# EasyEDA Pro project ProPrj_dataloger_2025-03-19.epro

# Schematic Schematic2
Board Name: STM32; Create Date: 2024-11-12; Page Name: P1; Project Name: dataloger; Schematic Name: Schematic2; Update Date: 2025-01-06; Company: 嘉立创EDA; Page Size: A4; Version: V1.0
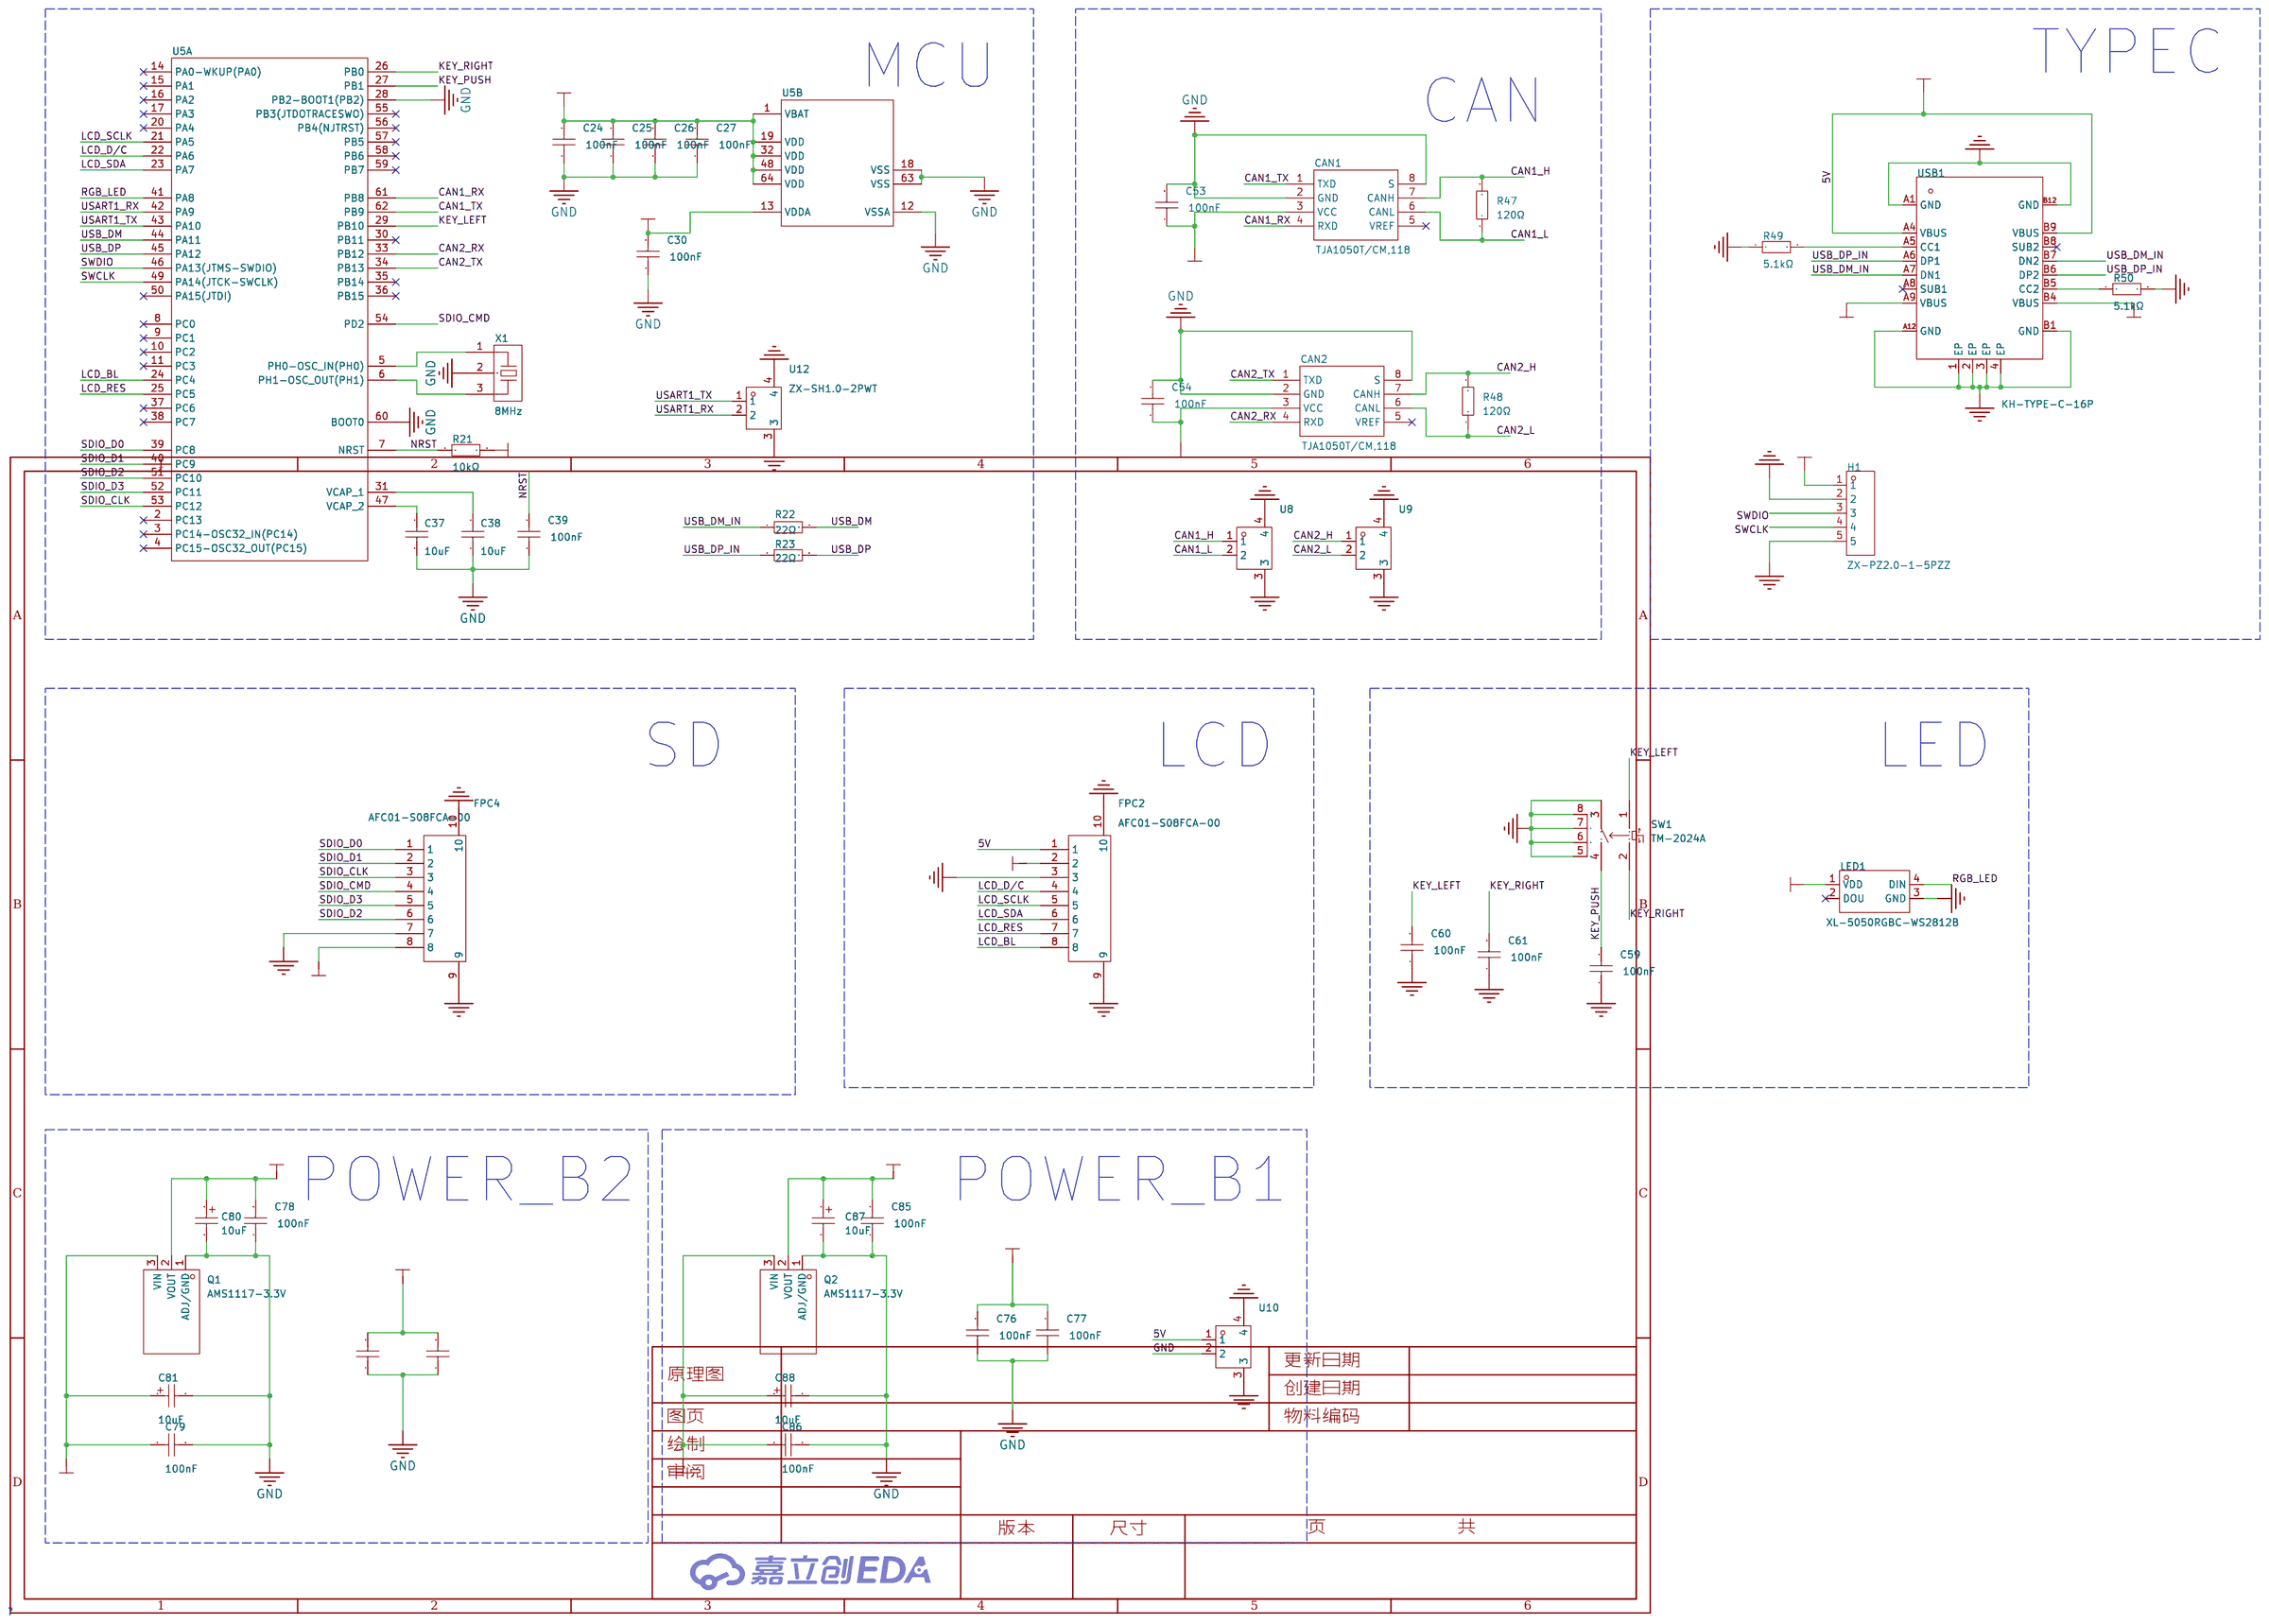
[diagram p0: schematic sheet]

## Parts
C24  100nF  [C0402]
C25  100nF  [C0402]
C26  100nF  [C0402]
C27  100nF  [C0402]
C30  100nF  [C0402]
C37  10uF  [C0402]
C38  10uF  [C0402]
C39  100nF  [C0402]
C53  100nF  [C0402]
C54  100nF  [C0402]
C59  100nF  [C0402]
C60  100nF  [C0402]
C61  100nF  [C0402]
C76  100nF  [C0402]
C77  100nF  [C0402]
C78  100nF  [C0402]
C79  100nF  [C0402]
C80  10uF  [CASE-A_3216]
C81  10uF  [CASE-A_3216]
C83  100nF  [C0402]
C85  100nF  [C0402]
C86  100nF  [C0402]
C87  10uF  [CASE-A_3216]
C88  10uF  [CASE-A_3216]
C89  100nF  [C0402]
CAN1  TJA1050T/CM,118  [SOIC-8_L5.0-W4.0-P1.27-LS6.0-BL]
CAN2  TJA1050T/CM,118  [SOIC-8_L5.0-W4.0-P1.27-LS6.0-BL]
FPC2  AFC01-S08FCA-00  [FPC-SMD_P0.50-8P_FGS-XJ-H2.0]
FPC4  AFC01-S08FCA-00  [FPC-SMD_P0.50-8P_FGS-XJ-H2.0]
H1  ZX-PZ2.0-1-5PZZ  [HDR-TH_5P-P2.00-V-M]
LED1  XL-5050RGBC-WS2812B  [LED-SMD_4P-L5.0-W5.0-BL_XL-5050RGBC]
Q1  AMS1117-3.3V  [SOT-89-3_L4.5-W2.5-P1.50-LS4.2-BR]
Q2  AMS1117-3.3V  [SOT-89-3_L4.5-W2.5-P1.50-LS4.2-BR]
R21  10kΩ  [R0402]
R22  22Ω  [R0402]
R23  22Ω  [R0402]
R47  120Ω  [R0402]
R48  120Ω  [R0402]
R49  5.1kΩ  [R0402]
R50  5.1kΩ  [R0402]
SW1  TM-2024A  [SW-SMD_TM-2024A]
U5  -  [LQFP-64_L10.0-W10.0-P0.50-LS12.0-BL]  (sections 1,2)
U8  WAFER-SH1.0-2PWB  [CONN-SMD_2P-P1.00_XUNPU_WAFER-SH1.0-2PWB]
U9  WAFER-SH1.0-2PWB  [CONN-SMD_2P-P1.00_XUNPU_WAFER-SH1.0-2PWB]
U10  WAFER-SH1.0-2PWB  [CONN-SMD_2P-P1.00_XUNPU_WAFER-SH1.0-2PWB]
U12  ZX-SH1.0-2PWT  [CONN-SMD_2P-P1.00_HX-1.0-2P-WT]
USB1  KH-TYPE-C-16P  [USB-C-SMD_KH-TYPE-C-16P]
X1  8MHz  [OSC-SMD_3P-L3.2-W1.3-P1.2-L]

## Library data of the parts
C24-C27 C30 C39 C53 C54 C59-C61 C76-C79 C83 C85 C86 C89 = CC0402KRX7R9BB104: 容值:100nF;精度:±10%;额定电压:50V;温度系数:X7R;; LCSC Part Name: 100nF ±10% 50V; Supplier Part: C131394; Manufacturer: YAGEO(国巨); Supplier Footprint: 0402; Datasheet: https://atta.szlcsc.com/upload/public/pdf/source/20170925/C131394_1506321459057990237.pdf; Supplier: LCSC; Tolerance: ±10%; Voltage Rated: 50V; Temperature Coefficient: X7R
C37 C38 = CC0402MRX5R5BB106: 容值:10uF;精度:±20%;额定电压:6.3V;温度系数:X5R;; LCSC Part Name: 10uF ±20% 6.3V; Supplier Part: C105884; Manufacturer: YAGEO(国巨); Supplier Footprint: 0402; Datasheet: https://atta.szlcsc.com/upload/public/pdf/source/20170728/C105884_1501225684064848716.pdf; Supplier: LCSC; Tolerance: ±20%; Voltage Rated: 6.3V; Temperature Coefficient: X5R
C80 C81 C87 C88 = TAJA106K010RNJ: 容值:10uF;精度:±10%;额定电压:10V;等效串联电阻:3Ω@100kHz;; LCSC Part Name: 10uF ±10% 10V; Supplier Part: C7177; Manufacturer: Kyocera AVX; Supplier Footprint: CASE-A-3216; JLCPCB Part Class: 扩展库; Datasheet: https://atta.szlcsc.com/upload/public/pdf/source/20160107/1457707750344.pdf; Supplier: LCSC; Tolerance: ±10%; Rated Voltage: 10V; Equivalent Series Resistance(ESR): 3Ω@100kHz; Operating Temperature: -55℃~+125℃
CAN1 CAN2 = TJA1050T/CM,118: 类型:收发器;协议类别:CAN总线;; Supplier Part: C6952; Manufacturer: NXP(恩智浦); Supplier Footprint: SOIC-8_150mil; JLCPCB Part Class: Basic Part; Datasheet: https://atta.szlcsc.com/upload/public/pdf/source/20140411/1457707042917.pdf; Supplier: LCSC; Type: 收发器; Protocol: CAN总线; Supply Voltage: 4.75V ~ 5.25V
FPC2 FPC4 = AFC01-S08FCA-00: 锁定特性:翻盖式;触点类型:下接;触点数量:8P;间距:0.5mm;安装类型:卧贴;; LCSC Part Name: 间距:0.5mm P数:8P 翻盖式 下接; Supplier Part: C262657; Manufacturer: JS(钜硕电子); Supplier Footprint: SMD,P=0.5mm,卧贴; JLCPCB Part Class: 扩展库; Datasheet: https://atta.szlcsc.com/upload/public/pdf/source/20190816/C413942_2A72D1AC756EAE17EEDF756A339D4500.pdf; Supplier: LCSC; Locking Feature: 翻盖式; Contact Type: 下接; Number of Contacts: 8P; Pitch: 0.5mm; Mounting Type: 卧贴; FFC, FCB Thickness: 0.3mm; Height Above Board: 2mm
H1 = ZX-PZ2.0-1-5PZZ: 插针结构:1x5P;间距:2mm;行距:-;圆针/方针:方针;安装类型:直插;排数:单排;总PIN位数:5P;额定电流:1.5A;额定电压:500V;配合针长度:3.9mm;塑高:2mm;端接针长度:2.8mm;触头材质:黄铜;触头镀层:金;工作温度范围:-40℃~+105℃;焊接温度(最大值):-;颜色:黑色;; LCSC Part Name: 1x5P 间距:2mm 方针 直插; Supplier Part: C7501286; Manufacturer: Megastar(兆星); Supplier Footprint: 插件,P=2mm; JLCPCB Part Class: Extended Part; Datasheet: https://atta.szlcsc.com/upload/public/pdf/source/20230809/E150E06394DAD00A792C01E768CBE2ED.pdf; Supplier: LCSC; Pin Structure: 1x5P; Pitch: 2mm; Circluar Pins/Square Pins: 方针; Mounting Type: 直插; Number of Rows: 单排; Number of Pins: 5P; Current Rating (Max): 1.5A; Voltage Rating (Max): 500V; Length of Mating Pin: 3.9mm; Insulation Height: 2mm; Length of End Connection Pin: 2.8mm; Contact Material: 黄铜; Contact Plating: 金; Operating Temperature Range: -40℃~+105℃; Color: 黑色
LED1 = XL-5050RGBC-WS2812B: 5050七彩幻彩透明贴片LED灯珠 5050 幻彩透明四脚 ws2812B 内置驱动IC; Supplier Part: C2843785; Manufacturer: XINGLIGHT(成兴光); Supplier Footprint: SMD5050; JLCPCB Part Class: 扩展库; Datasheet: https://atta.szlcsc.com/upload/public/pdf/source/20240412/E1004CAA80592E31D08BFE019083806F.pdf; Supplier: LCSC
Q1 Q2 = AMS1117-3.3V_C5120796: 输出类型:固定;最大输入电压:18V;输出电压:3.3V;最大输出电流:1A;输出极性:正极;; LCSC Part Name: 输入18V 输出3.3V 1A; Supplier Part: C5120796; Manufacturer: MSKSEMI(美森科); Supplier Footprint: SOT-89; JLCPCB Part Class: Extended Part; Datasheet: https://atta.szlcsc.com/upload/public/pdf/source/20220727/5E62EAC46FFFF83337622C0FBE1B6BF8.pdf; Supplier: LCSC; Output Type: 固定; Maximum Input Voltage: 18V; Output Voltage: 3.3V; MAX Output Current: 1A; Dropout Voltage: 1.4V@(1A); standby current: 12mA; Operating Temperature: 0℃~+125℃; Output Polarity: 正极; Number of Outputs: 1
R21 = 0402WGF1002TCE: 电阻类型:厚膜电阻;阻值:10kΩ;精度:±1%;功率:62.5mW;温度系数:±100ppm/;最大工作电压:50V;工作温度范围:-55~+155;; LCSC Part Name: 10kΩ ±1% 62.5mW; Supplier Part: C25744; Manufacturer: UNI-ROYAL(厚声); Supplier Footprint: 0402; Datasheet: https://atta.szlcsc.com/upload/public/pdf/source/20200306/C422600_1E6D84923E4A46A82E41ADD87F860B5C.pdf; Supplier: LCSC; Type: 厚膜电阻; Tolerance: ±1%; Power(Watts): 62.5mW; Temperature Coefficient: ±100ppm/; Overload Voltage (Max): 50V; Operating Temperature Range: -55~+155
R22 R23 = CR0402FF22R0G: 电阻类型:厚膜电阻;阻值:22Ω;精度:±1%;功率:1/16W;温度系数:±200ppm/;最大工作电压:50V;工作温度范围:-55~+125;; LCSC Part Name: 22Ω ±1%; Supplier Part: C100318; Manufacturer: LIZ(丽智电子); Supplier Footprint: 0402; Datasheet: https://atta.szlcsc.com/upload/public/pdf/source/20170408/1491621411980.pdf; Supplier: LCSC; Type: 厚膜电阻; Tolerance: ±1%; Power(Watts): 1/16W; Temperature Coefficient: ±200ppm/; Overload Voltage (Max): 50V; Operating Temperature Range: -55~+125
R47 R48 = 0402WGF1200TCE: 电阻类型:厚膜电阻;阻值:120Ω;精度:±1%;功率:62.5mW;最大工作电压:50V;温度系数:±100ppm/℃;; LCSC Part Name: 120Ω ±1% 62.5mW 厚膜电阻; Supplier Part: C25079; Manufacturer: UNI-ROYAL(厚声); Supplier Footprint: 0402; JLCPCB Part Class: 基础库; Datasheet: https://atta.szlcsc.com/upload/public/pdf/source/20200306/C422600_1E6D84923E4A46A82E41ADD87F860B5C.pdf; Supplier: LCSC; Type: 厚膜电阻; Tolerance: ±1%; Power(Watts): 62.5mW; Overload Voltage (Max): 50V; Temperature Coefficient: ±100ppm/℃; Operating Temperature Range: -55℃~+155℃
R49 R50 = 0402WGF5101TCE: 电阻类型:厚膜电阻;阻值:5.1kΩ;精度:±1%;功率:62.5mW;最大工作电压:50V;温度系数:±100ppm/℃;; LCSC Part Name: 5.1kΩ ±1% 62.5mW 厚膜电阻; Supplier Part: C25905; Manufacturer: UNI-ROYAL(厚声); Supplier Footprint: 0402; JLCPCB Part Class: 基础库; Datasheet: https://atta.szlcsc.com/upload/public/pdf/source/20200306/C422600_1E6D84923E4A46A82E41ADD87F860B5C.pdf; Supplier: LCSC; Type: 厚膜电阻; Tolerance: ±1%; Power(Watts): 62.5mW; Overload Voltage (Max): 50V; Temperature Coefficient: ±100ppm/℃; Operating Temperature Range: -55℃~+155℃
SW1 = TM-2024A: 四脚两档拨轮开关TM-2024A; LCSC Part Name: 四脚两档拨轮开关TM-2024A; Supplier Part: C561480; Manufacturer: XKB Connection(中国星坤); Supplier Footprint: SMD; JLCPCB Part Class: 扩展库; Datasheet: https://atta.szlcsc.com/upload/public/pdf/source/20211011/7A4DB3DC37E7D5823B6D92C66ED3191E.pdf; Supplier: LCSC
U5 = STM32F405RGT6: 主频（MAX):168MHz;工作电压:1.8V ~ 3.6V;; Supplier Part: C15742; Manufacturer: ST(意法半导体); Supplier Footprint: LQFP-64_10x10x05P; Datasheet: https://atta.szlcsc.com/upload/public/pdf/source/20140724/1457707160365.pdf; Supplier: LCSC; Speed: 168MHz; Voltage - Supply (Vcc/Vdd): 1.8V ~ 3.6V; Program Memory Size: 1MB; RAM Size: 192KB; Number of I/O: 51; A/D: 16x12bit; D/A: 2x12bit; PWM: 56; LCD: MOTOROLA 6800 AND INTEL  8080 TYPE LCD DIRECTLY; UART/USART: 4 USART+2 UART; SPI: 3; I2C（SMBUS/PMBUS）: 3; USB Device: 1; USB Host/OTG: 1; CAN: 2
U8-U10 = WAFER-SH1.0-2PWB: 插针结构:1x2P;间距:1mm;安装方式:卧贴;总PIN数:2P;排数:1;每排PIN数:2;额定电流:1A;工作温度范围:-25℃~+85℃;; LCSC Part Name: 1x2P 间距:1mm 卧贴; Supplier Part: C3029341; Manufacturer: XUNPU(讯普); Supplier Footprint: SMD,P=1mm,卧贴; JLCPCB Part Class: Extended Part; Datasheet: https://atta.szlcsc.com/upload/public/pdf/source/20220527/1879B8210BD3B2006BCEAC1A40D397B6.pdf; Supplier: LCSC; Pins Structure: 1x2P; Pitch: 1mm; Mounting Style: 卧贴; Number of Pins: 2P; Number of Rows: 1; Number of PINs Per Row: 2; Current Rating (Max): 1A; Operating Temperature Range: -25℃~+85℃
U12 = ZX-SH1.0-2PWT: 插针结构:1x2P;间距:1mm;安装方式:卧贴;参考系列:SH;总PIN数:2P;排数:1;每排PIN数:2;行距:-;额定电流:1A;触头材质:黄铜;触头镀层:锡;工作温度范围:-25℃~+85℃;; Supplier Part: C7430444; Manufacturer: Megastar(兆星); Supplier Footprint: SMD,P=1mm,卧贴; JLCPCB Part Class: 扩展库; Datasheet: https://atta.szlcsc.com/upload/public/pdf/source/20230619/7431D9A6D6A5DA3D0954B6B913C94054.pdf; Supplier: LCSC; Pins Structure: 1x2P; Pitch: 1mm; Mounting Style: 卧贴; Reference Series: SH; Number of Pins: 2P; Number of Rows: 1; Number of PINs Per Row: 2; Current Rating (Max): 1A; Contact Material: 黄铜; Contact Plating: 锡; Operating Temperature Range: -25℃~+85℃
USB1 = KH-TYPE-C-16P: 连接器类型:Type-C;标准:-;公母:母;端口数量:1;触点数量:16P;安装方式:卧贴;额定电流 - 电源:3A;工作温度范围:-40℃~+85℃;; LCSC Part Name: Type-C 母 卧贴; Supplier Part: C709357; Manufacturer: kinghelm(金航标); Supplier Footprint: SMD; JLCPCB Part Class: 扩展库; Datasheet: https://atta.szlcsc.com/upload/public/pdf/source/20200911/C709357_AA8DCEB38BB20E3035A7ED7AE7667837.pdf; Supplier: LCSC; Connector Type: Type-C; Gender: 母; Number of Ports: 1; Number of Contacts: 16P; Mounting Style: 卧贴; Current Rating - Power (Max): 3A; Operating Temperature Range: -40℃~+85℃
X1 = CSTCE8M00G15C99-R0: 频率:8MHz;频率容差:±0.1%;内藏负载电容:33pF;谐振阻抗:40Ω;; LCSC Part Name: 8M ±0.1% 33pF; Supplier Part: C110614; Manufacturer: muRata(村田); Supplier Footprint: SMD3213-3P; Datasheet: https://atta.szlcsc.com/upload/public/pdf/source/20180327/C110614_9F5031E08ADB10DE4472527BF78A8CAF.pdf; Supplier: LCSC; Frequency Stability: ±0.13%; Frequency Tolerance: ±0.1%; Built-in Load Capacitance: 33pF; Resonant Impedance: 40Ω; Operating Temperature: -40~+125

## Nets
5V: C53.1 C54.1 C79.2 C81.1 C86.2 C88.1 CAN1.3(VCC) CAN2.3(VCC) FPC2.1 LED1.1(VDD) Q1.3(VIN) Q2.3(VIN) U10.1 USB1.A4(VBUS) USB1.A9(VBUS) USB1.B4(VBUS) USB1.B9(VBUS)
GND: C24.1 C25.1 C26.1 C27.1 C30.1 C37.1 C38.1 C39.1 C53.2 C54.2 C59.1 C60.1 C61.1 C76.1 C77.1 C78.1 C79.1 C80.2 C81.2 C83.1 C85.1 C86.1 C87.2 C88.2 C89.1 CAN1.2(GND) CAN1.8(S) CAN2.2(GND) CAN2.8(S) FPC2.3 FPC2.9 FPC2.10 FPC4.7 FPC4.9 FPC4.10 H1.2 H1.5 LED1.3(GND) Q1.1(ADJ/GND) Q2.1(ADJ/GND) R49.1 R50.2 SW1.3 SW1.5 SW1.6 SW1.7 SW1.8 U5.12(VSSA) U5.18(VSS) U5.28(PB2-BOOT1(PB2)) U5.60(BOOT0) U5.63(VSS) U8.3 U8.4 U9.3 U9.4 U10.2 U10.3 U10.4 U12.3 U12.4 USB1.1(EP) USB1.2(EP) USB1.3(EP) USB1.4(EP) USB1.A1(GND) USB1.A12(GND) USB1.B1(GND) USB1.B12(GND) X1.2
B1_3V3: C24.2 C25.2 C26.2 C27.2 C30.2 C76.2 C77.2 C85.2 C87.1 H1.1 Q2.2(VOUT) R21.1 U5.1(VBAT) U5.13(VDDA) U5.19(VDD) U5.32(VDD) U5.48(VDD) U5.64(VDD)
B2_3V3: C78.2 C80.1 C83.2 C89.2 FPC2.2 FPC4.8 Q1.2(VOUT)
CAN1_H: CAN1.7(CANH) R47.2 U8.1
CAN1_L: CAN1.6(CANL) R47.1 U8.2
CAN1_RX: CAN1.4(RXD) U5.61(PB8)
CAN1_TX: CAN1.1(TXD) U5.62(PB9)
CAN2_H: CAN2.7(CANH) R48.2 U9.1
CAN2_L: CAN2.6(CANL) R48.1 U9.2
CAN2_RX: CAN2.4(RXD) U5.33(PB12)
CAN2_TX: CAN2.1(TXD) U5.34(PB13)
KEY_LEFT: C60.2 SW1.1 U5.29(PB10)
KEY_PUSH: C59.2 SW1.4 U5.27(PB1)
KEY_RIGHT: C61.2 SW1.2 U5.26(PB0)
LCD_BL: FPC2.8 U5.24(PC4)
LCD_D/C: FPC2.4 U5.22(PA6)
LCD_RES: FPC2.7 U5.25(PC5)
LCD_SCLK: FPC2.5 U5.21(PA5)
LCD_SDA: FPC2.6 U5.23(PA7)
NRST: C39.2 R21.2 U5.7(NRST)
RGB_LED: LED1.4(DIN) U5.41(PA8)
SDIO_CLK: FPC4.3 U5.53(PC12)
SDIO_CMD: FPC4.4 U5.54(PD2)
SDIO_D0: FPC4.1 U5.39(PC8)
SDIO_D1: FPC4.2 U5.40(PC9)
SDIO_D2: FPC4.6 U5.51(PC10)
SDIO_D3: FPC4.5 U5.52(PC11)
SWCLK: H1.4 U5.49(PA14(JTCK-SWCLK))
SWDIO: H1.3 U5.46(PA13(JTMS-SWDIO))
USART1_RX: U5.42(PA9) U12.2
USART1_TX: U5.43(PA10) U12.1
USB_DM: R22.2 U5.44(PA11)
USB_DM_IN: R22.1 USB1.A7(DN1) USB1.B7(DN2)
USB_DP: R23.2 U5.45(PA12)
USB_DP_IN: R23.1 USB1.A6(DP1) USB1.B6(DP2)
$1N5097: U5.5(PH0-OSC_IN(PH0)) X1.1
$1N5098: U5.6(PH1-OSC_OUT(PH1)) X1.3
$1N5099: C38.2 U5.31(VCAP_1)
$1N5100: C37.2 U5.47(VCAP_2)
$1N7761: R49.2 USB1.A5(CC1)
$1N7765: R50.1 USB1.B5(CC2)

Not connected (* = marked no-connect by the designer): CAN1 5(VREF)*; CAN2 5(VREF)*; LED1 2(DOU)*; U5 2(PC13)* 3(PC14-OSC32_IN(PC14))* 4(PC15-OSC32_OUT(PC15))* 8(PC0)* 9(PC1)* 10(PC2)* 11(PC3)* 14(PA0-WKUP(PA0))* 15(PA1)* 16(PA2)* 17(PA3)* 20(PA4)* 30(PB11)* 35(PB14)* 36(PB15)* 37(PC6)* 38(PC7)* 50(PA15(JTDI))* 55(PB3(JTDOTRACESWO))* 56(PB4(NJTRST))* 57(PB5)* 58(PB6)* 59(PB7)*; USB1 A8(SUB1)* B8(SUB2)*

## Notes on the sheet
- TYPEC
- MCU
- CAN
- SD
- LCD
- LED
- POWER_B2
- POWER_B1

# Schematic Schematic3
Board Name: extern; Create Date: 2024-11-13; Page Name: P1; Project Name: dataloger; Schematic Name: Schematic3; Update Date: 2025-01-05; Company: 嘉立创EDA; Page Size: A4; Version: V1.0
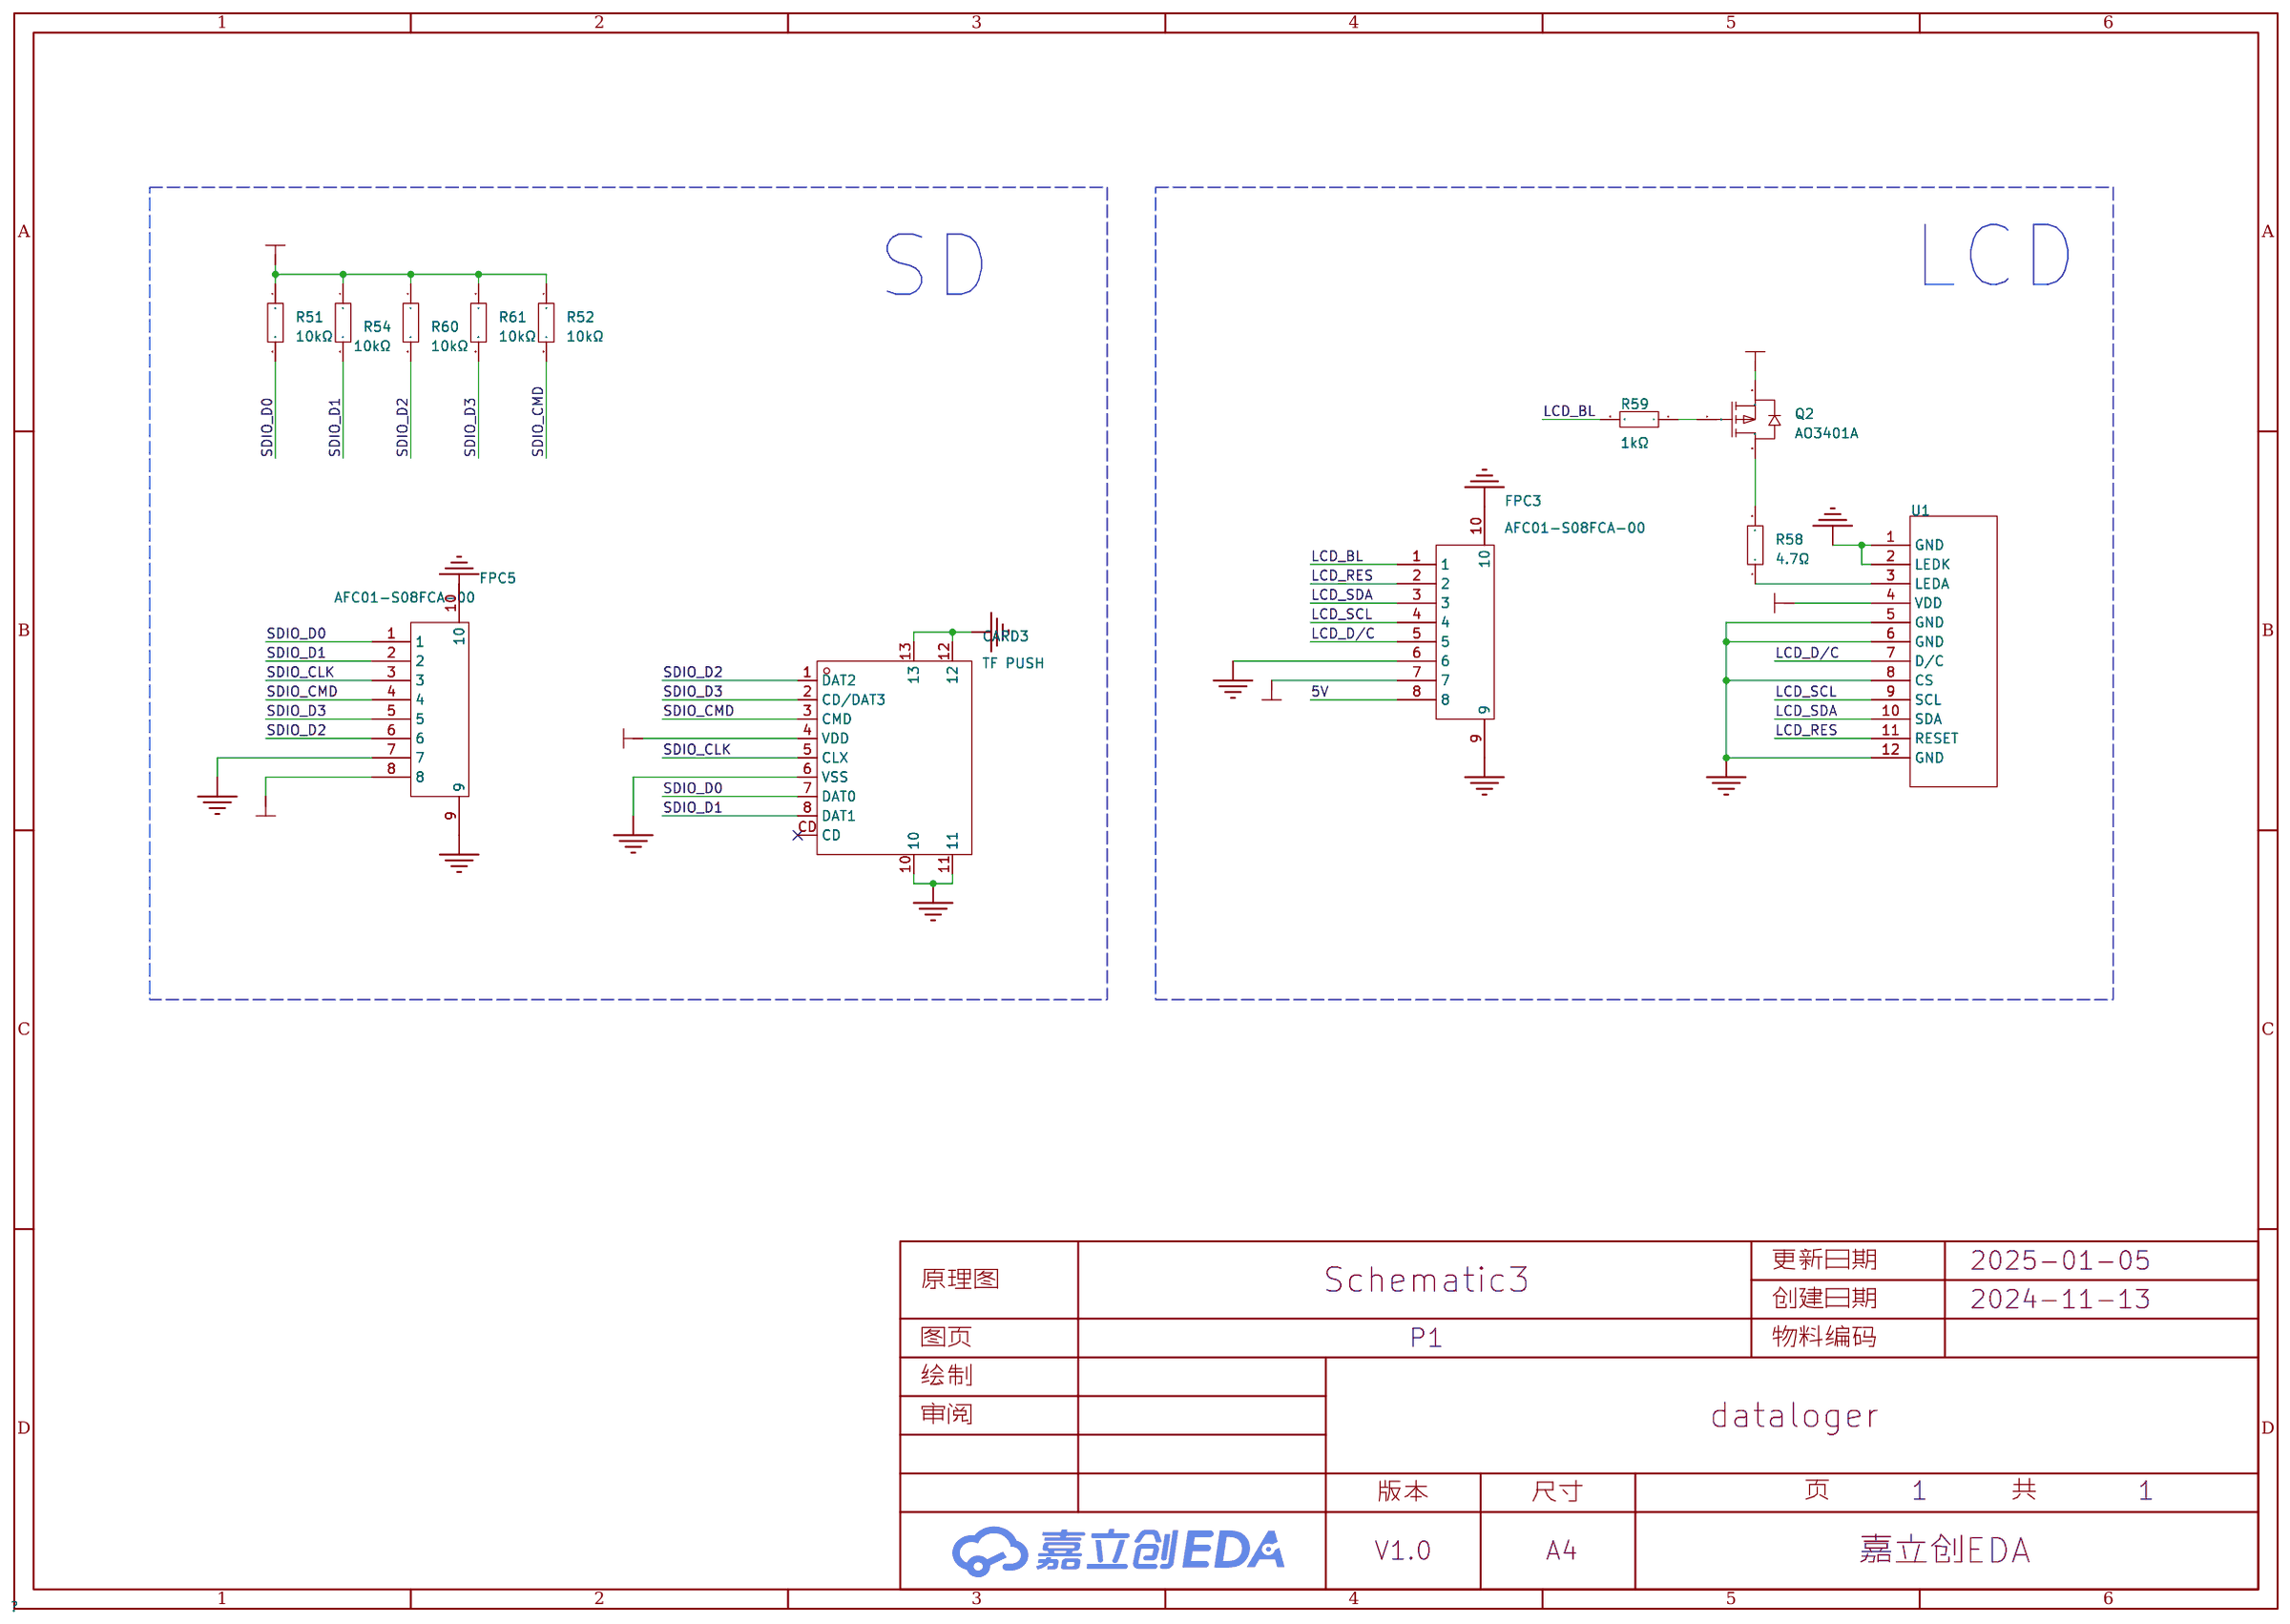
[diagram p1: schematic sheet]

## Parts
CARD3  TF PUSH  [TF-SMD_TF-PUSH]
FPC3  AFC01-S08FCA-00  [FPC-SMD_P0.50-8P_FGS-XJ-H2.0]
FPC5  AFC01-S08FCA-00  [FPC-SMD_P0.50-8P_FGS-XJ-H2.0]
Q2  AO3401A  [SOT-23_L2.9-W1.3-P1.90-LS2.4-BR]
R51  10kΩ  [R0402]
R52  10kΩ  [R0402]
R54  10kΩ  [R0402]
R58  4.7Ω  [R0402]
R59  1kΩ  [R0402]
R60  10kΩ  [R0402]
R61  10kΩ  [R0402]
U1  -  [ZJY183YT-PG38]

## Library data of the parts
CARD3 = TF PUSH: 卡连接方式:自弹式;卡类型:MicroSD卡(TF卡);连接器类型:卡座;本体最大高度:2mm;工作温度范围:-20℃~+90℃;; LCSC Part Name: 自弹式 MicroSD卡(TF卡) 卡座; Supplier Part: C393941; Manufacturer: SHOU HAN(首韩); Supplier Footprint: SMD; JLCPCB Part Class: 扩展库; Datasheet: https://atta.szlcsc.com/upload/public/pdf/source/20191011/C393941_0DDD896EE907FEB750D8B7B8982E2A67.pdf; Supplier: LCSC; Card Connection Mode: 自弹式; Card Type: MicroSD卡(TF卡); Connector Type: 卡座; Additional Card Detection Pins: 无; Maximum Body Height: 2mm; Operating Temperature Range: -20℃~+90℃
FPC3 FPC5 = AFC01-S08FCA-00: 锁定特性:翻盖式;触点类型:下接;触点数量:8P;间距:0.5mm;安装类型:卧贴;; LCSC Part Name: 间距:0.5mm P数:8P 翻盖式 下接; Supplier Part: C262657; Manufacturer: JS(钜硕电子); Supplier Footprint: SMD,P=0.5mm,卧贴; JLCPCB Part Class: 扩展库; Datasheet: https://atta.szlcsc.com/upload/public/pdf/source/20190816/C413942_2A72D1AC756EAE17EEDF756A339D4500.pdf; Supplier: LCSC; Locking Feature: 翻盖式; Contact Type: 下接; Number of Contacts: 8P; Pitch: 0.5mm; Mounting Type: 卧贴; FFC, FCB Thickness: 0.3mm; Height Above Board: 2mm
Q2 = AO3401A_C15127: 类型:1个P沟道;漏源电压(Vdss):30V;连续漏极电流(Id):4A;功率(Pd):1.4W;导通电阻(RDS(on)@Vgs,Id):44mΩ@10V,4.3A;阈值电压(Vgs(th)@Id):1.3V@250uA;; LCSC Part Name: 1个P沟道 耐压:30V 电流:4A; Supplier Part: C15127; Manufacturer: AOS; Supplier Footprint: SOT-23; JLCPCB Part Class: 基础库; Datasheet: https://atta.szlcsc.com/upload/public/pdf/source/20160507/1462613609053.pdf; Supplier: LCSC; Type: 1个P沟道; Drain Source Voltage (Vdss): 30V; Continuous Drain Current (Id): 4A; Power Dissipation (Pd): 1.4W; Drain Source On Resistance (RDS(on)@Vgs,Id): 44mΩ@10V,4.3A; Gate Threshold Voltage (Vgs(th)@Id): 1.3V@250uA; Total Gate Charge (Qg@Vgs): 12.2nC@4.5V; Input Capacitance (Ciss@Vds): 1.2nF@15V; Operating Temperature: -55℃~+150℃@(Tj)
R51 R52 R54 R60 R61 = 0402WGF1002TCE: 电阻类型:厚膜电阻;阻值:10kΩ;精度:±1%;功率:62.5mW;温度系数:±100ppm/;最大工作电压:50V;工作温度范围:-55~+155;; LCSC Part Name: 10kΩ ±1% 62.5mW; Supplier Part: C25744; Manufacturer: UNI-ROYAL(厚声); Supplier Footprint: 0402; Datasheet: https://atta.szlcsc.com/upload/public/pdf/source/20200306/C422600_1E6D84923E4A46A82E41ADD87F860B5C.pdf; Supplier: LCSC; Type: 厚膜电阻; Tolerance: ±1%; Power(Watts): 62.5mW; Temperature Coefficient: ±100ppm/; Overload Voltage (Max): 50V; Operating Temperature Range: -55~+155
R58 = 0402WGF470KTCE: 电阻类型:厚膜电阻;阻值:4.7Ω;精度:±1%;功率:62.5mW;最大工作电压:50V;温度系数:±200ppm/℃;; LCSC Part Name: 4.7Ω ±1% 62.5mW 厚膜电阻; Supplier Part: C25121; Manufacturer: UNI-ROYAL(厚声); Supplier Footprint: 0402; JLCPCB Part Class: 扩展库; Datasheet: https://atta.szlcsc.com/upload/public/pdf/source/20200306/C422600_1E6D84923E4A46A82E41ADD87F860B5C.pdf; Supplier: LCSC; Type: 厚膜电阻; Tolerance: ±1%; Power(Watts): 62.5mW; Overload Voltage (Max): 50V; Temperature Coefficient: ±200ppm/℃; Operating Temperature Range: -55℃~+155℃
R59 = 0402WGF1001TCE: 电阻类型:厚膜电阻;阻值:1kΩ;精度:±1%;功率:62.5mW;最大工作电压:50V;温度系数:±100ppm/℃;; LCSC Part Name: 1kΩ ±1% 62.5mW 厚膜电阻; Supplier Part: C11702; Manufacturer: UNI-ROYAL(厚声); Supplier Footprint: 0402; JLCPCB Part Class: 基础库; Datasheet: https://atta.szlcsc.com/upload/public/pdf/source/20200306/C422600_1E6D84923E4A46A82E41ADD87F860B5C.pdf; Supplier: LCSC; Type: 厚膜电阻; Tolerance: ±1%; Power(Watts): 62.5mW; Overload Voltage (Max): 50V; Temperature Coefficient: ±100ppm/℃; Operating Temperature Range: -55℃~+155℃
U1 = ZJY183TY-PG38

## Nets
5V: FPC3.8
GND: CARD3.6(VSS) CARD3.10 CARD3.11 CARD3.12 CARD3.13 FPC3.6 FPC3.9 FPC3.10 FPC5.7 FPC5.9 FPC5.10 U1.1(GND) U1.2(LEDK) U1.5(GND) U1.6(GND) U1.8(CS) U1.12(GND)
VCC_3V3: CARD3.4(VDD) FPC3.7 FPC5.8 Q2.2(S) R51.1 R52.1 R54.1 R60.1 R61.1 U1.4(VDD)
LCD_BL: FPC3.1 R59.2
LCD_D/C: FPC3.5 U1.7(D/C)
LCD_RES: FPC3.2 U1.11(RESET)
LCD_SCL: FPC3.4 U1.9(SCL)
LCD_SDA: FPC3.3 U1.10(SDA)
SDIO_CLK: CARD3.5(CLX) FPC5.3
SDIO_CMD: CARD3.3(CMD) FPC5.4 R52.2
SDIO_D0: CARD3.7(DAT0) FPC5.1 R51.2
SDIO_D1: CARD3.8(DAT1) FPC5.2 R54.2
SDIO_D2: CARD3.1(DAT2) FPC5.6 R60.2
SDIO_D3: CARD3.2(CD/DAT3) FPC5.5 R61.2
$1N441: R58.1 U1.3(LEDA)
$1N448: Q2.1(G) R59.1
$1N449: Q2.3(D) R58.2

Not connected (* = marked no-connect by the designer): CARD3 CD*

## Notes on the sheet
- LCD
- SD

# Board PCB2
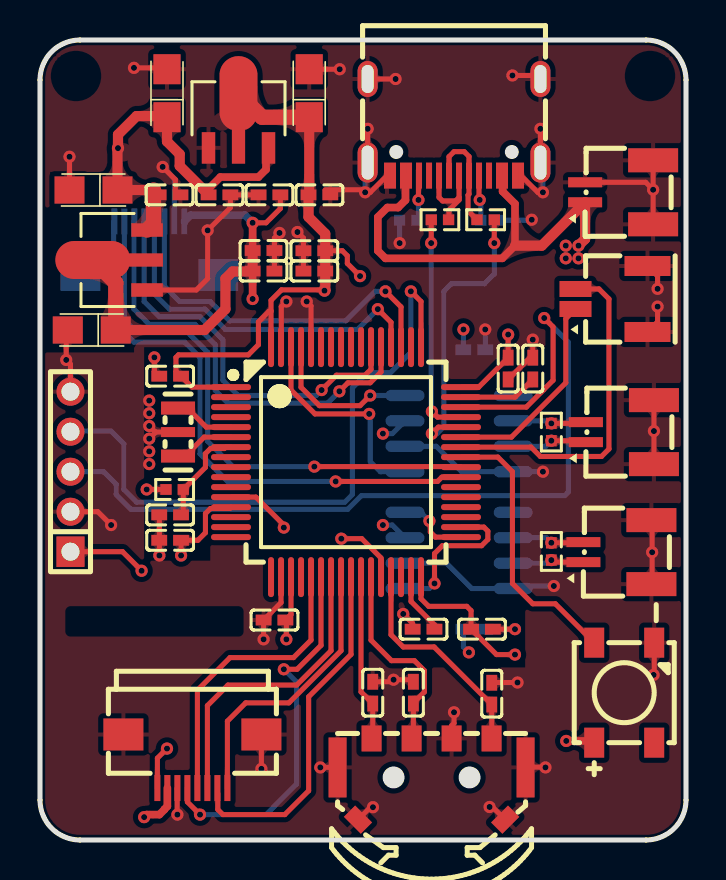
[diagram p2: board, top side]
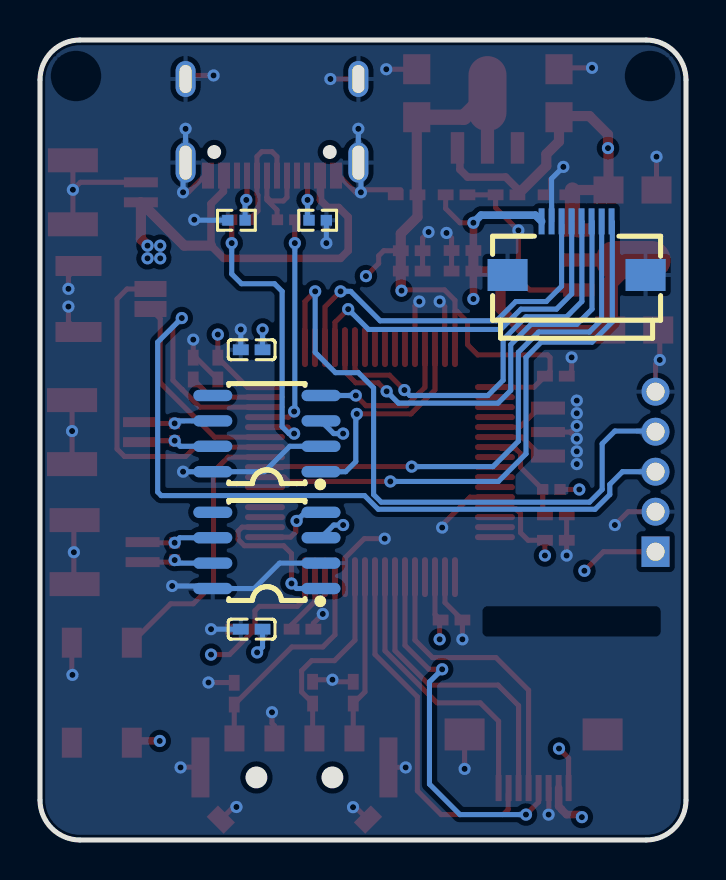
[diagram p3: board, bottom side, seen from below]

Outline 32.3 x 40 mm; copper layers: Top Layer, Inner1, Inner2, Bottom Layer. Coordinates in mm from the lower left corner of the outline.
Outline path: 0,38 0,2 arc(0.59,0.59) 2,0 30.3,0 arc(31.71,0.59) 32.3,2 32.3,38 arc(31.71,39.41) 30.3,40 2,40 arc(0.59,39.41) 0,38
Stack: Top Layer 0.035mm 外层铜厚1oz / Dielectric1 0.2104mm 7628 RC49% 8.6mil / Inner1 0.0152mm 内层铜厚 / Dielectric2 1.065mm 1.1mm H/HOZ Copper / Inner2 0.0152mm 内层铜厚 / Dielectric3 0.2104mm 7628 RC49% 8.6mil / Bottom Layer 0.035mm 外层铜厚1oz

## Design rules (mm)
template: 自定义配置
spacing copperThickness1oz (default): track to track 0.102, other pairs 0.152 to 0.3
spacing copperThickness2oz: track to track 0.203, other pairs 0.152 to 0.3
track width copperThickness1oz (default): min 0.127, default 0.254, max 2.54
track width copperThickness2oz: min 0.203, default 0.254, max 2.54
differential pair differentialPair (default): width min 0.127, default 0.254, max 2.54; gap min 0.152, default 0.152
via viaSize (default): diameter min 0.5, default 0.61, max 10; hole min 0.3, default 0.305, max 6.299

## Placement (name value [footprint] x y rotation side)
C24  100nF  [C0402]  11.72 11 0 top
C25  100nF  [C0402]  22.1 10.54 180 top
C26  100nF  [C0402]  23.41 23.57 90 top
C27  100nF  [C0402]  6.51 23.19 0 top
C30  100nF  [C0402]  6.51 14.99 0 top
C37  10uF  [C0402]  24.64 23.57 270 top
C38  10uF  [C0402]  19.18 10.54 0 top
C39  100nF  [C0402]  6.51 16.26 0 top
C53  100nF  [C0402]  21.72 24.51 0 bottom
C54  100nF  [C0402]  21.72 10.54 0 bottom
C59  100nF  [C0402]  18.67 7.37 270 top
C60  100nF  [C0402]  22.59 7.32 270 top
C61  100nF  [C0402]  16.64 7.37 270 top
C76  100nF  [C0402]  13.72 28.45 0 top
C77  100nF  [C0402]  13.72 29.46 0 top
C78  100nF  [C0402]  11.47 32.26 0 top
C79  100nF  [C0402]  6.48 32.26 180 top
C80  10uF  [CASE-A_3216]  2.59 25.5 180 top
C81  10uF  [CASE-A_3216]  2.68 32.5 180 top
C83  100nF  [C0402]  11.18 28.45 180 top
C85  100nF  [C0402]  13.97 32.26 180 top
C86  100nF  [C0402]  8.97 32.26 180 top
C87  10uF  [CASE-A_3216]  13.46 37.34 90 top
C88  10uF  [CASE-A_3216]  6.35 37.34 90 top
C89  100nF  [C0402]  11.18 29.47 180 top
CAN1  TJA1050T/CM,118  [SOIC-8_L5.0-W4.0-P1.27-LS6.0-BL]  20.96 20.32 90 bottom
CAN2  TJA1050T/CM,118  [SOIC-8_L5.0-W4.0-P1.27-LS6.0-BL]  20.96 14.48 90 bottom
FPC2  AFC01-S08FCA-00  [FPC-SMD_P0.50-8P_FGS-XJ-H2.0]  7.62 3.94 0 top
FPC4  AFC01-S08FCA-00  [FPC-SMD_P0.50-8P_FGS-XJ-H2.0]  5.47 29.59 0 bottom
H1  ZX-PZ2.0-1-5PZZ  [HDR-TH_5P-P2.00-V-M]  1.52 18.42 90 top
LED1  XL-5050RGBC-WS2812B  [LED-SMD_4P-L5.0-W5.0-BL_XL-5050RGBC]  29.21 7.37 0 top
Q1  AMS1117-3.3V  [SOT-89-3_L4.5-W2.5-P1.50-LS4.2-BR]  4 29 0 top
Q2  AMS1117-3.3V  [SOT-89-3_L4.5-W2.5-P1.50-LS4.2-BR]  9.93 35.96 270 top
R21  10kΩ  [R0402]  6.73 17.53 0 top
R22  22Ω  [R0402]  22.28 31.01 0 top
R23  22Ω  [R0402]  20 31.01 180 top
R47  120Ω  [R0402]  25.57 20.4 270 top
R48  120Ω  [R0402]  25.57 14.43 270 top
R49  5.1kΩ  [R0402]  22.48 30.99 180 bottom
R50  5.1kΩ  [R0402]  18.41 30.99 180 bottom
SW1  TM-2024A  [SW-SMD_TM-2024A]  19.58 3.05 180 top
U5  -  [LQFP-64_L10.0-W10.0-P0.50-LS12.0-BL]  15.3 18.89 270 top
U8  WAFER-SH1.0-2PWB  [CONN-SMD_2P-P1.00_XUNPU_WAFER-SH1.0-2PWB]  29 20.39 90 top
U9  WAFER-SH1.0-2PWB  [CONN-SMD_2P-P1.00_XUNPU_WAFER-SH1.0-2PWB]  28.87 14.39 90 top
U10  WAFER-SH1.0-2PWB  [CONN-SMD_2P-P1.00_XUNPU_WAFER-SH1.0-2PWB]  28.96 32.39 90 top
U12  ZX-SH1.0-2PWT  [CONN-SMD_2P-P1.00_HX-1.0-2P-WT]  28.57 27.05 90 top
USB1  KH-TYPE-C-16P  [USB-C-SMD_KH-TYPE-C-16P]  20.7 35.64 180 top
X1  8MHz  [OSC-SMD_3P-L3.2-W1.3-P1.2-L]  6.9 20.4 270 top

## Footprints (pads in the part's own frame, mm; a bottom-side part is the same pattern mirrored in y, then rotated)
C0402
  rect 0.79x0.54 smd: 1(-0.545,0) 2(0.545,0)
CASE-A_3216
  rect 1.5x1.359 smd: 1(-1.2,0) 2(1.2,0)
CONN-SMD_2P-P1.00_HX-1.0-2P-WT
  rect 0.8x1.6 smd: 1(-0.5,1.8) 2(0.5,1.8)
  rect 1x2.3 smd: 3(1.65,-1.8) 4(-1.65,-1.8)
CONN-SMD_2P-P1.00_XUNPU_WAFER-SH1.0-2PWB
  rect 0.5x1.7 smd: 1(-0.5,1.7) 2(0.5,1.7)
  rect 1.2x2.5 smd: 3(1.6,-1.7) 4(-1.6,-1.7)
FPC-SMD_P0.50-8P_FGS-XJ-H2.0
  rect 0.3x1.3 smd: 1(-1.75,-1.34) 2(-1.252,-1.339) 3(-0.75,-1.34) 4(-0.25,-1.34) 5(0.25,-1.34) 6(0.75,-1.34) 7(1.25,-1.34) 8(1.75,-1.34)
  rect 2x1.6 smd: 9(3.45,1.34) 10(-3.45,1.34)
HDR-TH_5P-P2.00-V-M
  rect 1.524x1.4 hole 0.9: 1(-4,0)
  round 1.4 hole 0.9: 2(-2,0) 3(0,0) 4(2,0) 5(4,0)
LED-SMD_4P-L5.0-W5.0-BL_XL-5050RGBC
  rect 1x1.5 smd: 1(-1.5,-2.5) 2(1.5,-2.5) 3(1.5,2.5) 4(-1.5,2.5)
LQFP-64_L10.0-W10.0-P0.50-LS12.0-BL
  oval 0.3x2 smd: 1(-3.75,-5.75) 2(-3.25,-5.75) 3(-2.75,-5.75) 4(-2.25,-5.75) 5(-1.75,-5.75) 6(-1.25,-5.75) 7(-0.75,-5.75) 8(-0.25,-5.75) 9(0.25,-5.75) 10(0.75,-5.75) 11(1.25,-5.75) 12(1.75,-5.75) 13(2.25,-5.75) 14(2.75,-5.75) 15(3.25,-5.75) 16(3.75,-5.75) 33(3.75,5.75) 34(3.25,5.75) 35(2.75,5.75) 36(2.25,5.75) 37(1.75,5.75) 38(1.25,5.75) 39(0.75,5.75) 40(0.25,5.75) 41(-0.25,5.75) 42(-0.75,5.75) 43(-1.25,5.75) 44(-1.75,5.75) 45(-2.25,5.75) 46(-2.75,5.75) 47(-3.25,5.75) 48(-3.75,5.75)
  oval 2x0.3 smd: 17(5.75,-3.75) 18(5.75,-3.25) 19(5.75,-2.75) 20(5.75,-2.25) 21(5.75,-1.75) 22(5.75,-1.25) 23(5.75,-0.75) 24(5.75,-0.25) 25(5.75,0.25) 26(5.75,0.75) 27(5.75,1.25) 28(5.75,1.75) 29(5.75,2.25) 30(5.75,2.75) 31(5.75,3.25) 32(5.75,3.75) 49(-5.75,3.75) 50(-5.75,3.25) 51(-5.75,2.75) 52(-5.75,2.25) 53(-5.75,1.75) 54(-5.75,1.25) 55(-5.75,0.75) 56(-5.75,0.25) 57(-5.75,-0.25) 58(-5.75,-0.75) 59(-5.75,-1.25) 60(-5.75,-1.75) 61(-5.75,-2.25) 62(-5.75,-2.75) 63(-5.75,-3.25) 64(-5.75,-3.75)
OSC-SMD_3P-L3.2-W1.3-P1.2-L
  rect 0.65x1.7 smd: 1(-1.199,0) 3(1.199,0)
  rect 0.5x1.7 smd: 2(0,0)
R0402
  rect 0.566x0.54 smd: 1(-0.433,0) 2(0.433,0)
SOIC-8_L5.0-W4.0-P1.27-LS6.0-BL
  oval 0.569x1.95 smd: 1(-1.905,-2.705) 2(-0.635,-2.705) 3(0.635,-2.705) 4(1.905,-2.705) 5(1.905,2.705) 6(0.635,2.705) 7(-0.635,2.705) 8(-1.905,2.705)
SOT-89-3_L4.5-W2.5-P1.50-LS4.2-BR
  rect 1.575x0.672 smd: 1(1.356,-1.5) 3(1.356,1.5)
  custom 5.377x1.9 smd: 2(-1.356,0)
SW-SMD_TM-2024A
  rect 1x1.3 smd: 1(-3,-2.03) 2(3,-2.03) 3(-1,-2.03) 4(1,-2.03)
  rect 0.9x3 smd: 5(-4.7,-0.58) 6(4.7,-0.58)
  rect 1.2x0.8 smd rot 45: 7(-3.68,2.03)
  rect 1.2x0.8 smd rot 135: 8(3.68,2.03)
USB-C-SMD_KH-TYPE-C-16P
  oval 1x2 hole 0.6x1.7: 1(-4.32,1.765) 2(4.32,1.765)
  oval 1x1.8 hole 0.6x1.4: 3(-4.32,-2.415) 4(4.32,-2.415)
  rect 0.3x1.3 smd: A1(-3.35,2.415) A4(-2.55,2.415) A5(-1.25,2.415) A6(-0.25,2.415) A7(0.25,2.415) A8(1.25,2.415) A9(2.55,2.415) A12(3.35,2.415) B1(3.05,2.415) B4(2.25,2.415) B5(1.75,2.415) B6(0.75,2.415) B7(-0.75,2.415) B8(-1.75,2.415) B9(-2.25,2.415) B12(-3.05,2.415)

## Nets
As in the schematic.

Pads without a net: CAN1 5; CAN2 5; LED1 2; U5 2 3 4 8 9 10 11 14 15 16 17 20 30 35 36 37 38 50 55 56 57 58 59; USB1 A8 B8

## Via types
v1: diameter 0.61, hole 0.305, Top Layer to Bottom Layer, 97 vias

## Routing (per net, layer and track width the routed paths; a pad name or vN(x,y) marks a point on that pad's centre or on a via; arc(x,y) is an arc through that point)
5V: length 148.7
  Top Layer w0.254: v1(6.35,4.57) 5.87,4.09 FPC2.1
  Top Layer w0.381: C86.2 8.43,32.56 9.02,33.15 10.92,33.15 11.3,33.53 11.3,34.48 Q2.3 ; 23.13,33.1 23.13,32.43 23.75,31.81 23.75,29.72 23.11,29.08 17.27,29.08 16.89,29.46 16.89,31.15 17.37,31.62 17.91,31.62 18.28,31.99 18.28,33.2 ; v1(26.31,4.95) 27.62,4.95 LED1.1
  Top Layer w0.508: 8.18,32.51 6.99,33.7 6.99,34.29 6.35,34.92 C88.1 6.29,36.19 4.83,36.19 3.9,35.27 v1(3.9,34.59) 3.87,34.57 3.87,32.5 5.68,32.5 ; v1(26.92,29.72) 27.26,30.05 U10.1 25.09,29.72 23.75,29.72
  Top Layer w0.762: 5.68,32.5 5.68,30.82 Q1.3
  Inner1 w0.254: v1(17.15,20.32) v1(17.15,15.75) ; v1(26.29,29.72) v1(26.29,29.08) v1(26.92,29.08) v1(26.92,29.72)
  Inner1 w0.508: 21.44,13.1 21.44,21.75 ; 21.44,13.1 v1(21.44,9.38) ; 21.44,13.1 22.61,11.94 24.81,11.94 26.31,10.44 v1(26.31,4.95) 6.73,4.95 v1(6.35,4.57) ; 21.44,21.75 21.44,25.25 v1(21.17,25.53) 18.8,25.53 18.16,24.89 18.16,21.34 v1(17.15,20.32) ; 21.44,21.75 22.68,22.99 26.03,22.99 26.8,23.75 26.8,27.69 25.65,28.83 ; 25.65,28.83 26.03,28.83 v1(26.29,29.08) ; 25.65,28.83 17.99,28.83 12.23,34.59 v1(3.9,34.59)
  Bottom Layer w0.254: v1(17.15,20.32) 17.62,20.32 CAN1.3 ; v1(17.15,15.75) 17.62,15.75 CAN2.3 ; C53.1 v1(21.17,25.53) ; C54.1 21.17,9.65 v1(21.44,9.38)
GND: length 121
  Top Layer w0.254: v1(22.48,1.65) 22.63,1.65 SW1.7 ; 5.79,20.4 5.76,20.4 v1(5.46,20.7) ; 5.79,20.4 X1.2 ; 5.79,20.4 v1(5.46,20.07) ; 6.77,32.51 6.77,33.02 v1(6.13,33.66) ; SW1.8 16.52,1.64 v1(16.65,1.64) ; v1(20.7,6.39) 20.7,5.83 20.58,5.71 SW1.3 ; C83.1 C89.1 11.72,30.1 v1(11.97,30.35) ; U10.3 v1(30.66,32.51) ; v1(30.66,32.51) 30.28,32.89 U10.2 ; v1(30.66,32.51) 30.66,30.78 ; v1(30.88,27.56) 30.88,28.2 30.38,28.7 ; LED1.3 30.71,8.29 v1(30.68,8.25) ; v1(25.02,35.56) USB1.1 ; USB1.A1 24.89,32.39 v1(25.15,32.39) ; v1(11.18,10.03) C24.1 12.05,11.87 U5.18 ; v1(23.88,7.87) 22.6,7.87 22.59,7.86 ; USB1.A12 16.52,32.39 v1(16.26,32.39) 16.13,32.51 14.26,32.51 ; v1(5.97,14.22) 5.97,16.15 5.96,16.16 C39.1 ; Q1.1 7.81,27.5 8.38,28.07 v1(8.38,30.48) 9.52,31.62 C86.1 C78.1 ; H1.5 1.52,23.79 v1(1.31,24) 1.31,25.42 C80.2 ; U12.4 30.88,25.91 v1(30.88,26.67) ; v1(23.62,38.23) 24.84,38.23 USB1.3 ; v1(24.64,25.02) C37.1 24.5,24.12 C26.1 ; U8.4 v1(30.7,20.45) U8.3 ; H1.2 2.89,16.42 v1(3.56,15.75) ; v1(15.07,15.07) 16.09,15.07 17.05,14.1 U5.28 ; v1(18.16,11.3) 18.63,10.83 C38.1 ; C88.2 6.28,38.61 v1(4.7,38.61) ; C81.2 v1(1.47,34.16) ; v1(6.87,1.27) 6.86,1.28 6.86,2.58 FPC2.3 ; v1(16.38,35.56) 16.38,33.87 USB1.2 ; v1(14.02,3.63) 14.02,3.63 15,3.63 15.01,3.63 ; v1(5.72,24.13) 5.72,23.43 C27.1 ; v1(17.78,38.05) USB1.4 ; U5.60 13.55,26.71 v1(13.34,26.92) ; C87.2 v1(14.99,38.54) ; U5.12 10.8,17.14 12.19,15.75 v1(12.19,15.62) ; v1(12.32,26.92) 12.06,26.67 12.06,24.66 U5.63 ; C76.1 C77.1 13.17,30.1 v1(12.87,30.4) ; U9.4 30.61,12.83 v1(30.61,14.39) 30.61,15.96 U9.3 ; v1(25.27,3.63) 25.26,3.64 24.3,3.64 SW1.5 ; FPC2.9 v1(11.07,3.56) ; C61.1 17.57,7.91 v1(17.68,8.01) 18.57,8.01 C59.1 ; v1(23.75,10.54) C25.1
  Bottom Layer w0.254: v1(6.13,33.66) 6.72,33.07 FPC4.7 ; C53.2 v1(22.26,25.53) ; C54.2 v1(23.75,10.54) ; R50.2 v1(17.98,29.84) ; 12.19,27.05 v1(12.32,26.92) ; R49.1 24.56,30.99 v1(24.59,31.01) ; CAN1.2 19.81,19.69 21.08,18.42 v1(25.15,18.42) ; v1(25.02,35.56) USB1.1 25.15,33.75 v1(25.15,32.39) ; v1(16.38,35.56) 16.38,33.87 USB1.2 16.26,33.75 v1(16.26,32.39) ; 18.25,13.84 20.32,13.84 21.59,12.57 CAN2.8 23.79,12.7 v1(25.69,12.7)
  vias: v1(5.46,21.97) v1(5.46,21.34) v1(5.46,19.43) v1(5.46,18.8)
B1_3V3: length 112.2
  Top Layer w0.254: U5.1 7.6,22.64 6.8,23.44 6.8,24.13 6.92,24.26 10.41,24.26 10.92,24.77 10.92,25.91 11.46,26.44 11.55,26.44 ; U5.48 21.94,22.64 C26.2 v1(23.41,25.27) ; v1(14.22,27.47) 14.18,27.51 12.08,27.51 11.55,26.98 11.55,26.44 ; U5.32 19.05,12.06 19.43,11.68 21.34,11.68 21.55,11.47 21.55,10.54 22.82,9.27 v1(23.75,9.27) ; H1.1 4.13,14.42 v1(5.08,13.46) ; R21.1 v1(5.33,17.53) ; C77.2 15.11,29.46 15.37,29.21 15.37,28.83 v1(16,28.19) ; 11.55,26.44 U5.64 ; v1(12.32,10.03) 12.32,10.95 C24.2 12.55,11.28 U5.19 ; 6.93,15.01 7,14.94 ; U5.13 9.48,16.57 8.52,16.57 8.27,16.32 8.27,15.36 7.89,14.99 C30.2 ; 7.05,14.89 v1(7.05,14.22)
  Top Layer w0.508: v1(14.22,27.47) 14.26,27.5 C76.2 C77.2 14.26,30.32 13.43,31.15 C85.2 13.46,32.3 C87.1
  Top Layer w0.762: Q2.2 11.1,36.14 C87.1
  Inner1 w0.254: v1(23.75,9.27) 21.97,7.49 18.8,7.49 18.03,6.73 16.13,6.73 13.46,9.4 13.46,10.43 ; 13.46,10.43 13.07,10.03 v1(12.32,10.03) ; 13.46,10.43 13.46,16.76 12.32,17.91 11.94,17.53 v1(5.33,17.53) 5.08,17.27 v1(5.08,13.46) 5.13,13.41 6.87,13.41 7.05,13.59 v1(7.05,14.22) ; v1(23.41,25.27) 23.41,27.39 22.61,28.19 v1(16,28.19)
  Inner1 w0.381: 12.32,17.91 12.32,24.11 14.22,26.01 v1(14.22,27.47)
B2_3V3: length 65.1
  Top Layer w0.254: 5.41,28.96 5.37,29 Q1.2 ; v1(10.63,30.86) 11.3,30.86 12.02,31.58 C78.2
  Top Layer w0.381: v1(5.21,1.14) 5.33,1.27 5.97,1.27 6.22,1.52 6.22,1.54 6.37,1.68 FPC2.2 ; C89.2 v1(10.63,30.86) ; v1(10.63,27.05) C83.2
  Top Layer w0.508: C80.1 8.23,25.5 9.27,26.54 9.27,28.07 9.63,28.43 10.61,28.43 C83.2 C89.2
  Top Layer w0.762: C80.1 3.79,27.86 Q1.2
  Inner1 w0.381: v1(5.21,1.14) 2.29,1.14 1.91,1.52 1.91,7.87 0.89,8.89 0.89,11.68 1.85,12.65 3.38,12.65 4.44,13.72 4.44,22.48 4.95,22.99 9.78,22.99 10.63,23.84 v1(10.63,27.05)
  Bottom Layer w0.381: v1(10.63,30.86) 10.25,31.24 7.53,31.24 FPC4.8
CAN1_H: length 3.8
  Top Layer w0.254: U8.1 27.23,19.96 v1(25.57,19.96)
  Bottom Layer w0.254: v1(25.57,19.96) 25.29,19.69 CAN1.7
CAN1_L: length 3.7
  Top Layer w0.254: U8.2 27.23,20.83 v1(25.57,20.83)
  Bottom Layer w0.254: CAN1.6 25.44,20.95 v1(25.57,20.83)
CAN1_RX: length 7.8
  Top Layer w0.254: v1(16.51,22.22) 16,21.72 13.97,21.72 13.05,22.64 U5.61
  Bottom Layer w0.254: CAN1.4 v1(16.51,22.22)
CAN1_TX: length 10.9
  Top Layer w0.254: U5.62 12.55,22.5 13.75,21.3 v1(16.46,21.3)
  Bottom Layer w0.254: 18.25,18.42 17.02,18.42 16.51,18.92 16.51,21.25 v1(16.46,21.3)
CAN2_H: length 3.6
  Top Layer w0.254: v1(25.57,14) 25.67,13.89 U9.1
  Bottom Layer w0.254: v1(25.57,14) 25.42,13.84 23.66,13.84
CAN2_L: length 3.6
  Top Layer w0.254: v1(25.57,14.86) 27.14,14.86 U9.2
  Bottom Layer w0.254: v1(25.57,14.86) 25.32,15.11 CAN2.6
CAN2_RX: length 3.6
  Top Layer w0.254: U5.33 19.77,15.14 19.52,15.4 19.52,15.91 v1(19.47,15.95)
  Bottom Layer w0.254: CAN2.4 19.04,16.38 v1(19.47,15.95)
CAN2_TX: length 7.9
  Top Layer w0.254: U5.34 22.19,15.64 22.39,15.44 22.39,15.03 22.08,14.71 20.12,14.71 19.73,14.32 v1(19.73,12.83)
  Bottom Layer w0.254: v1(19.73,12.83) 19.47,12.57 CAN2.1
KEY_LEFT: length 11.1
  Top Layer w0.254: SW1.1 22.59,5.09 C60.2 19.71,9.65 18.16,9.65 17.55,10.26 U5.29
KEY_PUSH: length 10.1
  Top Layer w0.254: U5.27 16.55,9.99 17.58,8.97 18.72,8.97 19.22,8.47 19.22,7.4 18.67,6.85 C59.2 18.67,5.17 SW1.4
KEY_RIGHT: length 8.3
  Top Layer w0.254: SW1.2 16.64,5.14 C61.2 16.05,7.41 U5.26
LCD_BL: length 14.2
  Top Layer w0.254: FPC2.8 9.37,5.94 10.29,6.86 12.45,6.86 15.05,9.46 U5.24
LCD_D/C: length 18.8
  Top Layer w0.254: FPC2.4 7.37,1.9 v1(8,1.27) ; v1(12.19,8.54) 12.85,8.54 14.05,9.73 U5.22
  Bottom Layer w0.254: v1(8,1.27) 11.3,1.27 12.83,2.79 12.83,7.9 v1(12.19,8.54)
LCD_RES: length 17.5
  Top Layer w0.254: 8.89,2.32 8.89,1.52 9.14,1.27 12.24,1.27 13.43,2.46 13.43,7.16 15.55,9.28 U5.25
LCD_SCLK: length 14.8
  Top Layer w0.254: 7.87,2.54 7.87,7.49 9.5,9.12 12.68,9.12 13.55,10 U5.21
LCD_SDA: length 15.2
  Top Layer w0.254: 8.37,2.54 8.37,6.72 9.4,7.75 12.83,7.75 14.55,9.47 U5.23
NRST: length 5
  Top Layer w0.254: C39.2 7.16,16.37 R21.2 8.27,18.63 8.27,19.32 8.52,19.57 9.21,19.57 9.28,19.64 U5.7
RGB_LED: length 13.8
  Top Layer w0.254: U5.41 22.89,19.14 23.62,18.42 23.62,12.83 24.64,11.81 25.76,11.81 LED1.4
SDIO_CLK: length 21.9
  Top Layer w0.254: U5.53 17.05,23.4 16.51,22.86 15.39,22.86 v1(14.97,22.43)
  Bottom Layer w0.254: v1(14.97,22.43) 14.38,21.84 9.4,21.84 8.76,22.48 8.76,24.77 7.75,25.78 5.46,25.78 4.7,26.54 4.7,30.91 FPC4.3
SDIO_CMD: length 20.1
  Top Layer w0.254: U5.54 16.55,23.54 16.26,23.24 14.82,23.24 v1(14.08,22.5)
  Bottom Layer w0.254: FPC4.4 5.21,30.92 5.21,26.92 5.97,26.16 8,26.16 9.14,25.02 9.14,22.99 9.91,22.22 13.81,22.22 v1(14.08,22.5)
SDIO_D0: length 28.6
  Top Layer w0.254: U5.39 20.09,18.14 19.88,17.93 v1(14.78,17.93)
  Bottom Layer w0.254: v1(14.78,17.93) 9.38,17.93 8,19.31 8,24.13 7.24,24.89 4.7,24.89 3.68,25.91 3.68,30.89 FPC4.1
SDIO_D1: length 27.4
  Top Layer w0.254: v1(13.72,18.67) 21.03,18.67 U5.40
  Bottom Layer w0.254: FPC4.2 4.22,26.01 4.83,25.4 7.37,25.4 8.38,24.38 8.38,19.94 9.65,18.67 v1(13.72,18.67)
SDIO_D2: length 18.7
  Top Layer w0.254: v1(17.27,27.43) 18.05,26.65 U5.51
  Bottom Layer w0.254: FPC4.6 6.22,27.69 6.99,26.92 8.51,26.92 9.47,25.96 15.29,25.96 16.76,27.43 v1(17.27,27.43)
SDIO_D3: length 18.1
  Top Layer w0.254: U5.52 17.55,25.88 v1(16.89,26.54)
  Bottom Layer w0.254: FPC4.5 5.72,30.93 5.72,27.31 6.48,26.54 8.25,26.54 9.27,25.53 15.88,25.53 v1(16.89,26.54)
SWCLK: length 32.1
  Top Layer w0.254: U5.49 19.05,26.92 v1(18.54,27.43)
  Bottom Layer w0.254: v1(18.54,27.43) 18.54,24.38 17.53,23.37 16.38,23.37 15.62,22.61 15.62,17.27 15.24,16.89 4.83,16.89 4.19,17.53 4.19,19.81 3.56,20.45 1.56,20.45 H1.4
SWDIO: length 44
  Top Layer w0.254: v1(25.21,26.1) 25.65,25.65 25.65,22.99 25.19,22.52 25.19,22.52 24.32,21.64 U5.46
  Bottom Layer w0.254: v1(25.21,26.1) 26.42,24.89 26.42,17.4 26.24,17.22 16.07,17.22 15.39,16.54 4.55,16.54 3.81,17.27 3.81,17.78 3.18,18.42 H1.3
USART1_RX: length 17.1
  Top Layer w0.254: U5.42 24.55,19.64 25.02,19.18 28.07,19.18 28.45,19.55 28.45,27.05 27.95,27.55 26.78,27.55
USART1_TX: length 10.3
  Top Layer w0.254: U5.43 23.57,20.14 26.29,22.86 26.29,26.06 26.78,26.55
USB_DM: length 14.7
  Top Layer w0.254: U5.44 19.92,20.64 v1(19.59,20.32) ; 22.71,31.01 v1(22.71,29.84)
  Bottom Layer w0.254: v1(19.59,20.32) 19.85,20.32 20.19,20.66 20.19,27.43 20.57,27.81 22.22,27.81 22.71,28.3 v1(22.71,29.84)
USB_DM_IN: length 5.5
  Top Layer w0.254: USB1.A7 20.45,34.17 20.7,34.42 21.21,34.42 21.45,34.17 USB1.B7 21.45,32.3 21.4,32.25 21.4,31.46 21.85,31.01
USB_DP: length 11.2
  Top Layer w0.254: v1(19.56,29.84) 19.56,29.85 R23.2 ; v1(19.59,21.42) 19.88,21.14 U5.45
  Bottom Layer w0.254: v1(19.56,29.84) 19.56,21.46 v1(19.59,21.42)
USB_DP_IN: length 4.7
  Top Layer w0.254: 20.96,32.13 20.96,33.22 USB1.A6 ; 20.96,32.13 20.96,32 20.45,31.5 20.45,31.03 R23.1 ; 20.96,32.13 20.78,31.95 20.13,31.95 19.95,32.13 USB1.B6
$1N5097: length 3.2
  Top Layer w0.254: 6.77,21.6 7.36,21.6 8.31,20.64 U5.5
$1N5098: length 3.2
  Top Layer w0.254: 6.77,19.2 7.26,19.2 8.21,20.14 U5.6
$1N5099: length 3.1
  Top Layer w0.254: C38.2 19.72,10.76 18.55,11.93 U5.31
$1N5100: length 4
  Top Layer w0.254: C37.2 23.76,22.14 U5.47
$1N7761: length 2.6
  Top Layer w0.254: v1(21.99,32) 21.95,32.04 21.95,33.53
  Bottom Layer w0.254: v1(21.99,32) 22.05,31.94 R49.2
$1N7765: length 2.6
  Top Layer w0.254: 18.95,33.53 18.92,33.5 v1(18.92,32)
  Bottom Layer w0.254: v1(18.92,32) 18.92,31.06 R50.1

## Copper pours and planes (outline as drawn; the poured copper is in the pictures)
5V on Inner1: 25.91,30.1 27.28,30.1 27.28,28.7 25.91,28.7
5V on Inner1: 16.76,20.83 17.53,20.83 17.53,15.24 16.76,15.24
GND on Top Layer: -6.22,42.93 37.72,42.93 37.72,-4.83 -6.22,-4.83
GND on Bottom Layer: -10.16,45.21 41.78,45.21 41.78,-6.22 -10.16,-6.22
GND on Inner2: 0.26,39.74 32.04,39.74 32.04,0.26 0.26,0.26

Small or netless copper shapes (teardrops, artwork), in the pictures only: 228 on Top Layer, 69 on Bottom Layer, 32 on Inner1, 21 on Inner2

# Board PCB3
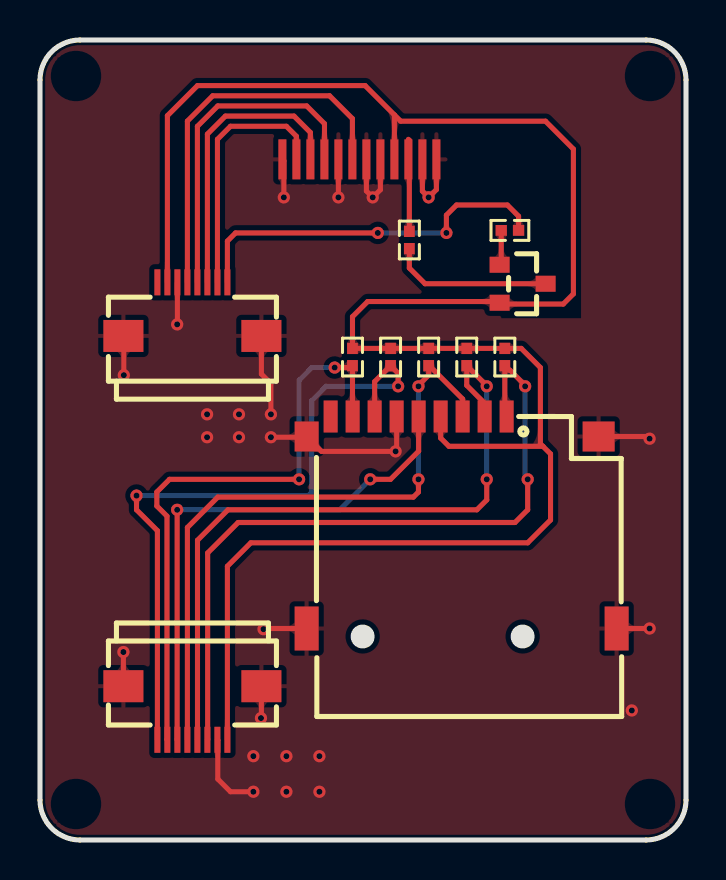
[diagram p4: board, top side]
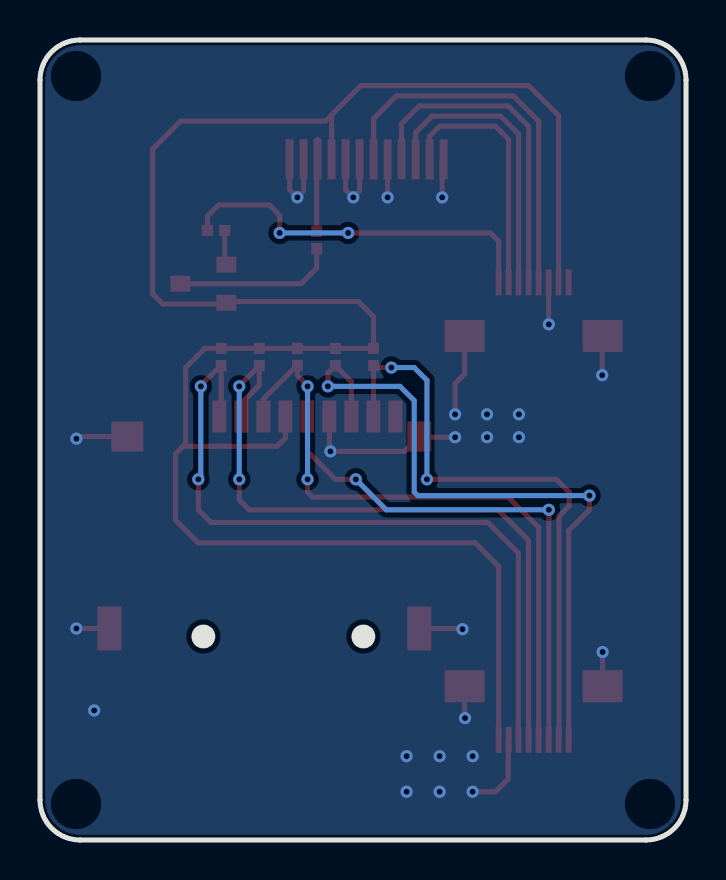
[diagram p5: board, bottom side, seen from below]

Outline 32.3 x 40 mm; copper layers: Top Layer, Bottom Layer. Coordinates in mm from the lower left corner of the outline.
Outline path: 0,38 0,2 arc(0.59,0.59) 2,0 30.3,0 arc(31.71,0.59) 32.3,2 32.3,38 arc(31.71,39.41) 30.3,40 2,40 arc(0.59,39.41) 0,38
Stack: Top Layer 0.035mm / Dielectric1 1.51mm FR4 er 4.5 / Bottom Layer 0.035mm

## Design rules (mm)
template: JLCPCB Capability(Two Layers Board)
spacing copperThickness1oz (default): track to track 0.102, other pairs 0.152 to 0.3
spacing copperThickness2oz: track to track 0.203, other pairs 0.152 to 0.3
track width copperThickness1oz (default): min 0.127, default 0.254, max 2.54
track width copperThickness2oz: min 0.203, default 0.254, max 2.54
differential pair differentialPair (default): width min 0.127, default 0.254, max 2.54; gap min 0.152, default 0.152
via viaSize (default): diameter min 0.5, default 0.61, max 10; hole min 0.3, default 0.305, max 6.3

## Placement (name value [footprint] x y rotation side)
CARD3  TF PUSH  [TF-SMD_TF-PUSH]  21.08 15.88 0 top
FPC3  AFC01-S08FCA-00  [FPC-SMD_P0.50-8P_FGS-XJ-H2.0]  7.62 26.54 180 top
FPC5  AFC01-S08FCA-00  [FPC-SMD_P0.50-8P_FGS-XJ-H2.0]  7.62 6.35 0 top
Q2  AO3401A  [SOT-23_L2.9-W1.3-P1.90-LS2.4-BR]  24.13 27.81 180 top
R51  10kΩ  [R0402]  17.53 24.15 270 top
R52  10kΩ  [R0402]  19.43 24.15 270 top
R54  10kΩ  [R0402]  15.62 24.15 270 top
R58  4.7Ω  [R0402]  18.47 30 270 top
R59  1kΩ  [R0402]  23.5 30.48 0 top
R60  10kΩ  [R0402]  23.24 24.15 270 top
R61  10kΩ  [R0402]  21.34 24.15 270 top
U1  -  [ZJY183YT-PG38]  15.97 34.03 90 top

## Footprints (pads in the part's own frame, mm; a bottom-side part is the same pattern mirrored in y, then rotated)
FPC-SMD_P0.50-8P_FGS-XJ-H2.0
  rect 0.3x1.3 smd: 1(-1.75,-1.34) 2(-1.252,-1.339) 3(-0.75,-1.34) 4(-0.25,-1.34) 5(0.25,-1.34) 6(0.75,-1.34) 7(1.25,-1.34) 8(1.75,-1.34)
  rect 2x1.6 smd: 9(3.45,1.34) 10(-3.45,1.34)
R0402
  rect 0.566x0.54 smd: 1(-0.433,0) 2(0.433,0)
SOT-23_L2.9-W1.3-P1.90-LS2.4-BR
  rect 1x0.8 smd: 1(1.15,-0.95) 2(1.15,0.95) 3(-1.15,0)
TF-SMD_TF-PUSH
  rect 0.7x1.6 smd: 1(2.25,5.3) 2(1.15,5.3) 3(0.05,5.3) 4(-1.05,5.3) 5(-2.15,5.3) 6(-3.25,5.3) 7(-4.35,5.3) 8(-5.45,5.3) CD(-6.55,5.3)
  rect 1.2x1.5 smd: 10(-7.75,4.3)
  rect 1.2x2.2 smd: 11(-7.75,-5.3) 12(7.75,-5.3)
  rect 1.6x1.5 smd: 13(6.85,4.3)
ZJY183YT-PG38
  rect 2x0.4 smd: 1(0,-3.85) 2(0,-3.15) 3(0,-2.45) 4(0,-1.75) 5(0,-1.05) 6(0,-0.35) 7(0,0.35) 8(0,1.05) 9(0,1.75) 10(0,2.45) 11(0,3.15) 12(0,3.85)

## Nets
As in the schematic.

Pads without a net: CARD3 CD

## Via types
v1: diameter 0.61, hole 0.305, Top Layer to Bottom Layer, 39 vias

## Routing (per net, layer and track width the routed paths; a pad name or vN(x,y) marks a point on that pad's centre or on a via; arc(x,y) is an arc through that point)
GND: length 42.3
  Top Layer w0.254: v1(4.19,23.24) 4.19,25.18 FPC3.9 ; v1(30.48,20.07) 30.37,20.17 CARD3.13 ; v1(11.05,6.1) 11.07,6.12 FPC5.9 ; CARD3.11 11.21,10.58 v1(11.18,10.54) ; v1(10.67,2.41) 9.53,2.41 8.89,3.05 8.89,4.99 FPC5.7 ; U1.2 19.12,32.44 v1(19.43,32.13) 19.82,32.52 U1.1 ; FPC3.10 11.07,23.3 11.55,22.82 v1(11.55,21.28) ; U1.6 16.32,32.45 v1(16.64,32.13) 17.02,32.51 U1.5 ; CARD3.6 17.83,19.48 v1(17.78,19.43) 14.08,19.43 CARD3.10 13.29,20.14 v1(11.55,20.14) ; U1.12 12.19,33.96 v1(12.19,32.13) ; FPC5.10 v1(4.17,9.4) ; v1(6.86,25.78) 6.87,25.79 FPC3.6 ; CARD3.12 v1(30.48,10.58) ; U1.8 v1(14.92,32.13)
  vias: v1(8.35,21.28) v1(8.35,20.14) v1(9.95,21.28) v1(9.95,20.14) v1(10.67,4.19) v1(12.32,4.19) v1(12.32,2.41) v1(13.97,4.19) v1(13.97,2.41) v1(29.59,6.48)
VCC_3V3: length 102.7
  Top Layer w0.254: R60.1 24.06,24.58 25.02,23.62 25.02,19.81 25.15,19.69 ; 25.15,19.69 25.53,19.3 25.53,16 24.38,14.86 10.54,14.86 9.37,13.69 FPC5.8 ; 25.15,19.69 20.45,19.69 20.03,20.1 CARD3.4 ; FPC3.7 6.37,36.22 7.87,37.72 16.26,37.72 17.72,36.25 ; 22.95,24.58 R61.1 R52.1 R51.1 R54.1 15.62,26.17 16.38,26.92 22.92,26.92 Q2.2 23.05,26.8 26.16,26.8 26.67,27.31 26.67,34.54 25.27,35.94 18.03,35.94 17.72,36.25 ; U1.4 17.72,36.25
LCD_BL: length 18.8
  Top Layer w0.254: v1(20.32,30.35) 20.32,31.24 20.83,31.75 23.37,31.75 23.93,31.19 R59.2 ; FPC3.1 9.37,29.94 9.78,30.35 v1(16.89,30.35)
  Bottom Layer w0.254: v1(16.89,30.35) v1(20.32,30.35)
LCD_D/C: length 19.3
  Top Layer w0.254: U1.7 15.62,36.07 14.48,37.21 8.64,37.21 7.37,35.94 FPC3.5
LCD_RES: length 12.7
  Top Layer w0.254: U1.11 12.82,35.19 12.32,35.69 9.53,35.69 8.87,35.03 FPC3.2
LCD_SCL: length 16.7
  Top Layer w0.254: U1.9 14.22,34.04 14.22,35.81 13.34,36.7 8.89,36.7 7.87,35.68 FPC3.4
LCD_SDA: length 14.6
  Top Layer w0.254: U1.10 13.52,35.38 12.7,36.19 9.27,36.19 8.37,35.29 FPC3.3
SDIO_CLK: length 26.5
  Top Layer w0.254: v1(6.86,16.51) 6.86,5.02 FPC5.3 ; v1(16.51,18.03) 17.53,18.03 18.93,19.44 CARD3.5
  Bottom Layer w0.254: v1(6.86,16.51) 14.99,16.51 v1(16.51,18.03)
SDIO_CMD: length 32.6
  Top Layer w0.254: CARD3.3 21.13,22.05 19.47,23.71 R52.2 19.43,23.24 18.92,22.73 ; v1(18.92,18.03) 18.92,17.4 18.67,17.14 8.89,17.14 7.37,15.62 FPC5.4
  Bottom Layer w0.254: v1(18.92,22.68) v1(18.92,18.03)
SDIO_D0: length 34.7
  Top Layer w0.254: CARD3.7 16.73,22.92 R51.2 17.91,23.34 17.91,22.73 ; v1(4.83,17.22) 4.83,16.51 5.87,15.47 FPC5.1
  Bottom Layer w0.254: v1(4.83,17.22) 13.41,17.22 13.59,17.4 13.59,21.97 14.3,22.68 v1(17.91,22.68)
SDIO_D1: length 30.4
  Top Layer w0.254: v1(14.73,23.62) 15.53,23.62 R54.2 15.62,21.18 CARD3.8 ; FPC5.2 6.35,5.03 6.35,16.19 5.84,16.7 5.84,17.4 6.48,18.03 v1(12.95,18.03)
  Bottom Layer w0.254: v1(12.95,18.03) 12.95,22.99 13.59,23.62 v1(14.73,23.62)
SDIO_D2: length 36.4
  Top Layer w0.254: 24.26,22.73 23.5,23.5 23.24,23.5 ; v1(24.38,18.03) 24.38,16.51 23.75,15.88 9.91,15.88 8.38,14.35 8.38,5.02 FPC5.6 ; CARD3.1 23.24,21.27 23.24,23.5 ; R60.2 23.24,23.5
  Bottom Layer w0.254: v1(24.38,18.03) 24.26,18.16 v1(24.26,22.68)
SDIO_D3: length 35.3
  Top Layer w0.254: v1(22.34,18.03) 22.34,17 21.84,16.51 9.4,16.51 7.87,14.99 7.87,5.01 FPC5.5 ; v1(22.34,22.68) 22.34,22.71 R61.2 21.34,22.73 22.23,21.84 CARD3.2
  Bottom Layer w0.254: v1(22.34,22.68) v1(22.34,18.03)
$1N441: length 4.6
  Top Layer w0.254: 18.42,35.03 18.47,34.98 R58.1
$1N448: length 1.8
  Top Layer w0.254: R59.1 23.06,28.84 Q2.1
$1N449: length 8.1
  Top Layer w0.254: R58.2 18.47,28.6 19.25,27.81 Q2.3

## Copper pours and planes (outline as drawn; the poured copper is in the pictures)
GND on Top Layer: -5.21,41.53 40,41.53 40,-3.68 -5.21,-3.68
GND on Bottom Layer: -6.35,41.78 42.54,41.78 42.54,-2.92 -6.35,-2.92

Small or netless copper shapes (teardrops, artwork), in the pictures only: 93 on Top Layer, 13 on Bottom Layer
